# EAGLE schematic Gausss pincond (EAGLE 9.6.2)
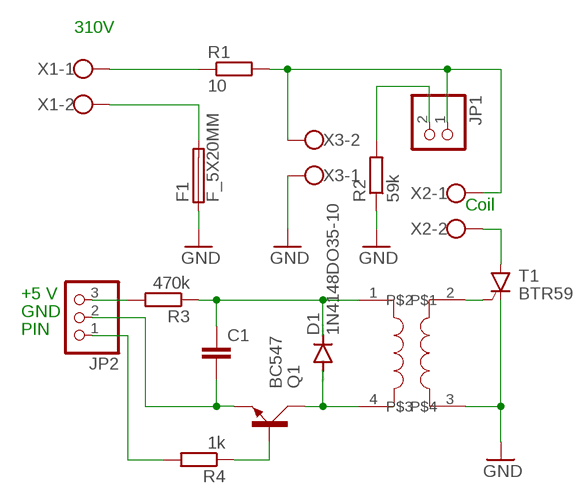
[diagram p0: schematic, sheet 1]

## Parts
C1  C-EU025-025X050  [C025-025X050]
D1  1N4148DO35-10  [DO35-10]
F1  F_5X20MM  FUSEBLANK_5X20MM  [FUSE_HOLDER_5X20MM]
JP1  PINHD-1X2  [1X02]
JP2  PINHD-1X3  [1X03]
Q1  BC547  [SOT54A]
R1  10  R-EU_0207/10  [0207/10]
R2  59k  R-EU_0207/10  [0207/10]
R3  470k  R-EU_0207/10  [0207/10]
R4  1k  R-EU_0207/10  [0207/10]
T1  BTR59  [SOT93S]
U$2  T  [SK11]
X1  W237-102  [W237-102]
X2  W237-102  [W237-102]
X3  W237-102  [W237-102]

## Nets
GND: F1.1 R2.1 T1.C U$2.3 X3.1
N$1: JP1.2 R2.2
N$2: T1.G U$2.2
N$3: JP2.1 R4.2
N$4: D1.A Q1.C U$2.4
N$5: C1.1 D1.C R3.1 U$2.1
N$6: JP2.3 R3.2
N$7: C1.2 JP2.2 Q1.E
N$8: JP1.1 R1.2 X2.1 X3.2
N$9: R1.1 X1.1
N$10: F1.2 X1.2
N$11: T1.A X2.2
N$12: Q1.B R4.1

## Notes on the sheet
- 310V
- Coil
- +5 V
- GND
- PIN

## Library data of the parts
C1 = rcl:C-EU: CAPACITOR, European symbol; SPICEPREFIX: C
D1 = diode:1N4148: DIODE high speed (Philips)
F1 = fuse:FUSE: Fuse; OC_FARNELL: unknown; OC_NEWARK: unknown
JP1 = pinhead:PINHD-1X2: PIN HEADER
JP2 = pinhead:PINHD-1X3: PIN HEADER
Q1 = transistor-small-signal:BC547: NPN TRANSISTOR
R1-R4 = rcl:R-EU_: RESISTOR, European symbol; SPICEPREFIX: R
T1 = triac:BTR59: THYRISTOR
U$2 = transf1:T
X1-X3 = con-wago-500:W237-102: WAGO SCREW CLAMP; MPN: 237-102; OC_FARNELL: unknown; OC_NEWARK: 70K9898